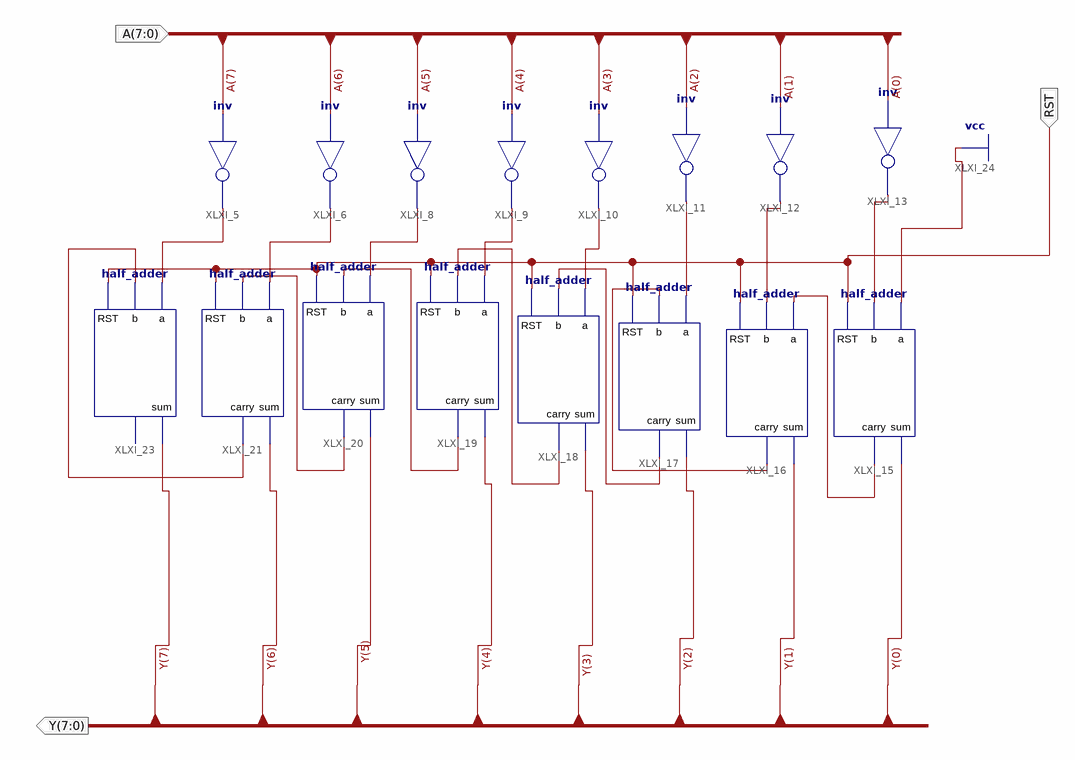
[diagram p0: schematic sheet 1]
// Xilinx ISE schematic complement_2s8.sch (artix7) as structural Verilog: 16 symbols, 3 ports
module complement_2s8 (
  input  [7:0] A,
  input  RST,
  output [7:0] Y
);

  wire XLXN_12, XLXN_13, XLXN_14, XLXN_18, XLXN_19, XLXN_21, XLXN_22, XLXN_41, XLXN_42, XLXN_43, XLXN_44,
       XLXN_46, XLXN_47, XLXN_105, XLXN_106;

  not XLXI_5 (XLXN_46, A[7]);
  not XLXI_6 (XLXN_44, A[6]);
  not XLXI_8 (XLXN_43, A[5]);
  not XLXI_9 (XLXN_42, A[4]);
  not XLXI_10 (XLXN_41, A[3]);
  not XLXI_11 (XLXN_22, A[2]);
  not XLXI_12 (XLXN_21, A[1]);
  not XLXI_13 (XLXN_12, A[0]);
  half_adder XLXI_15 (.a(1'b1), .b(XLXN_12), .carry(XLXN_13), .RST(RST), .sum(Y[0]));
  half_adder XLXI_16 (.a(XLXN_13), .b(XLXN_21), .carry(XLXN_14), .RST(RST), .sum(Y[1]));
  half_adder XLXI_17 (.a(XLXN_22), .b(XLXN_14), .carry(XLXN_105), .RST(RST), .sum(Y[2]));
  half_adder XLXI_18 (.a(XLXN_41), .b(XLXN_105), .carry(XLXN_106), .RST(RST), .sum(Y[3]));
  half_adder XLXI_19 (.a(XLXN_42), .b(XLXN_106), .carry(XLXN_18), .RST(RST), .sum(Y[4]));
  half_adder XLXI_20 (.a(XLXN_43), .b(XLXN_18), .carry(XLXN_19), .RST(RST), .sum(Y[5]));
  half_adder XLXI_21 (.a(XLXN_44), .b(XLXN_19), .carry(XLXN_47), .RST(RST), .sum(Y[6]));
  half_adder XLXI_23 (.a(XLXN_46), .b(XLXN_47), .RST(RST), .sum(Y[7]));  // open: carry
endmodule
